# Altium schematic sheet RobotBoard.SchDoc: Robot Board Layout
size A3; DrawnBy: Bto45, Mmc305; SheetNumber: 1; SheetTotal: 2
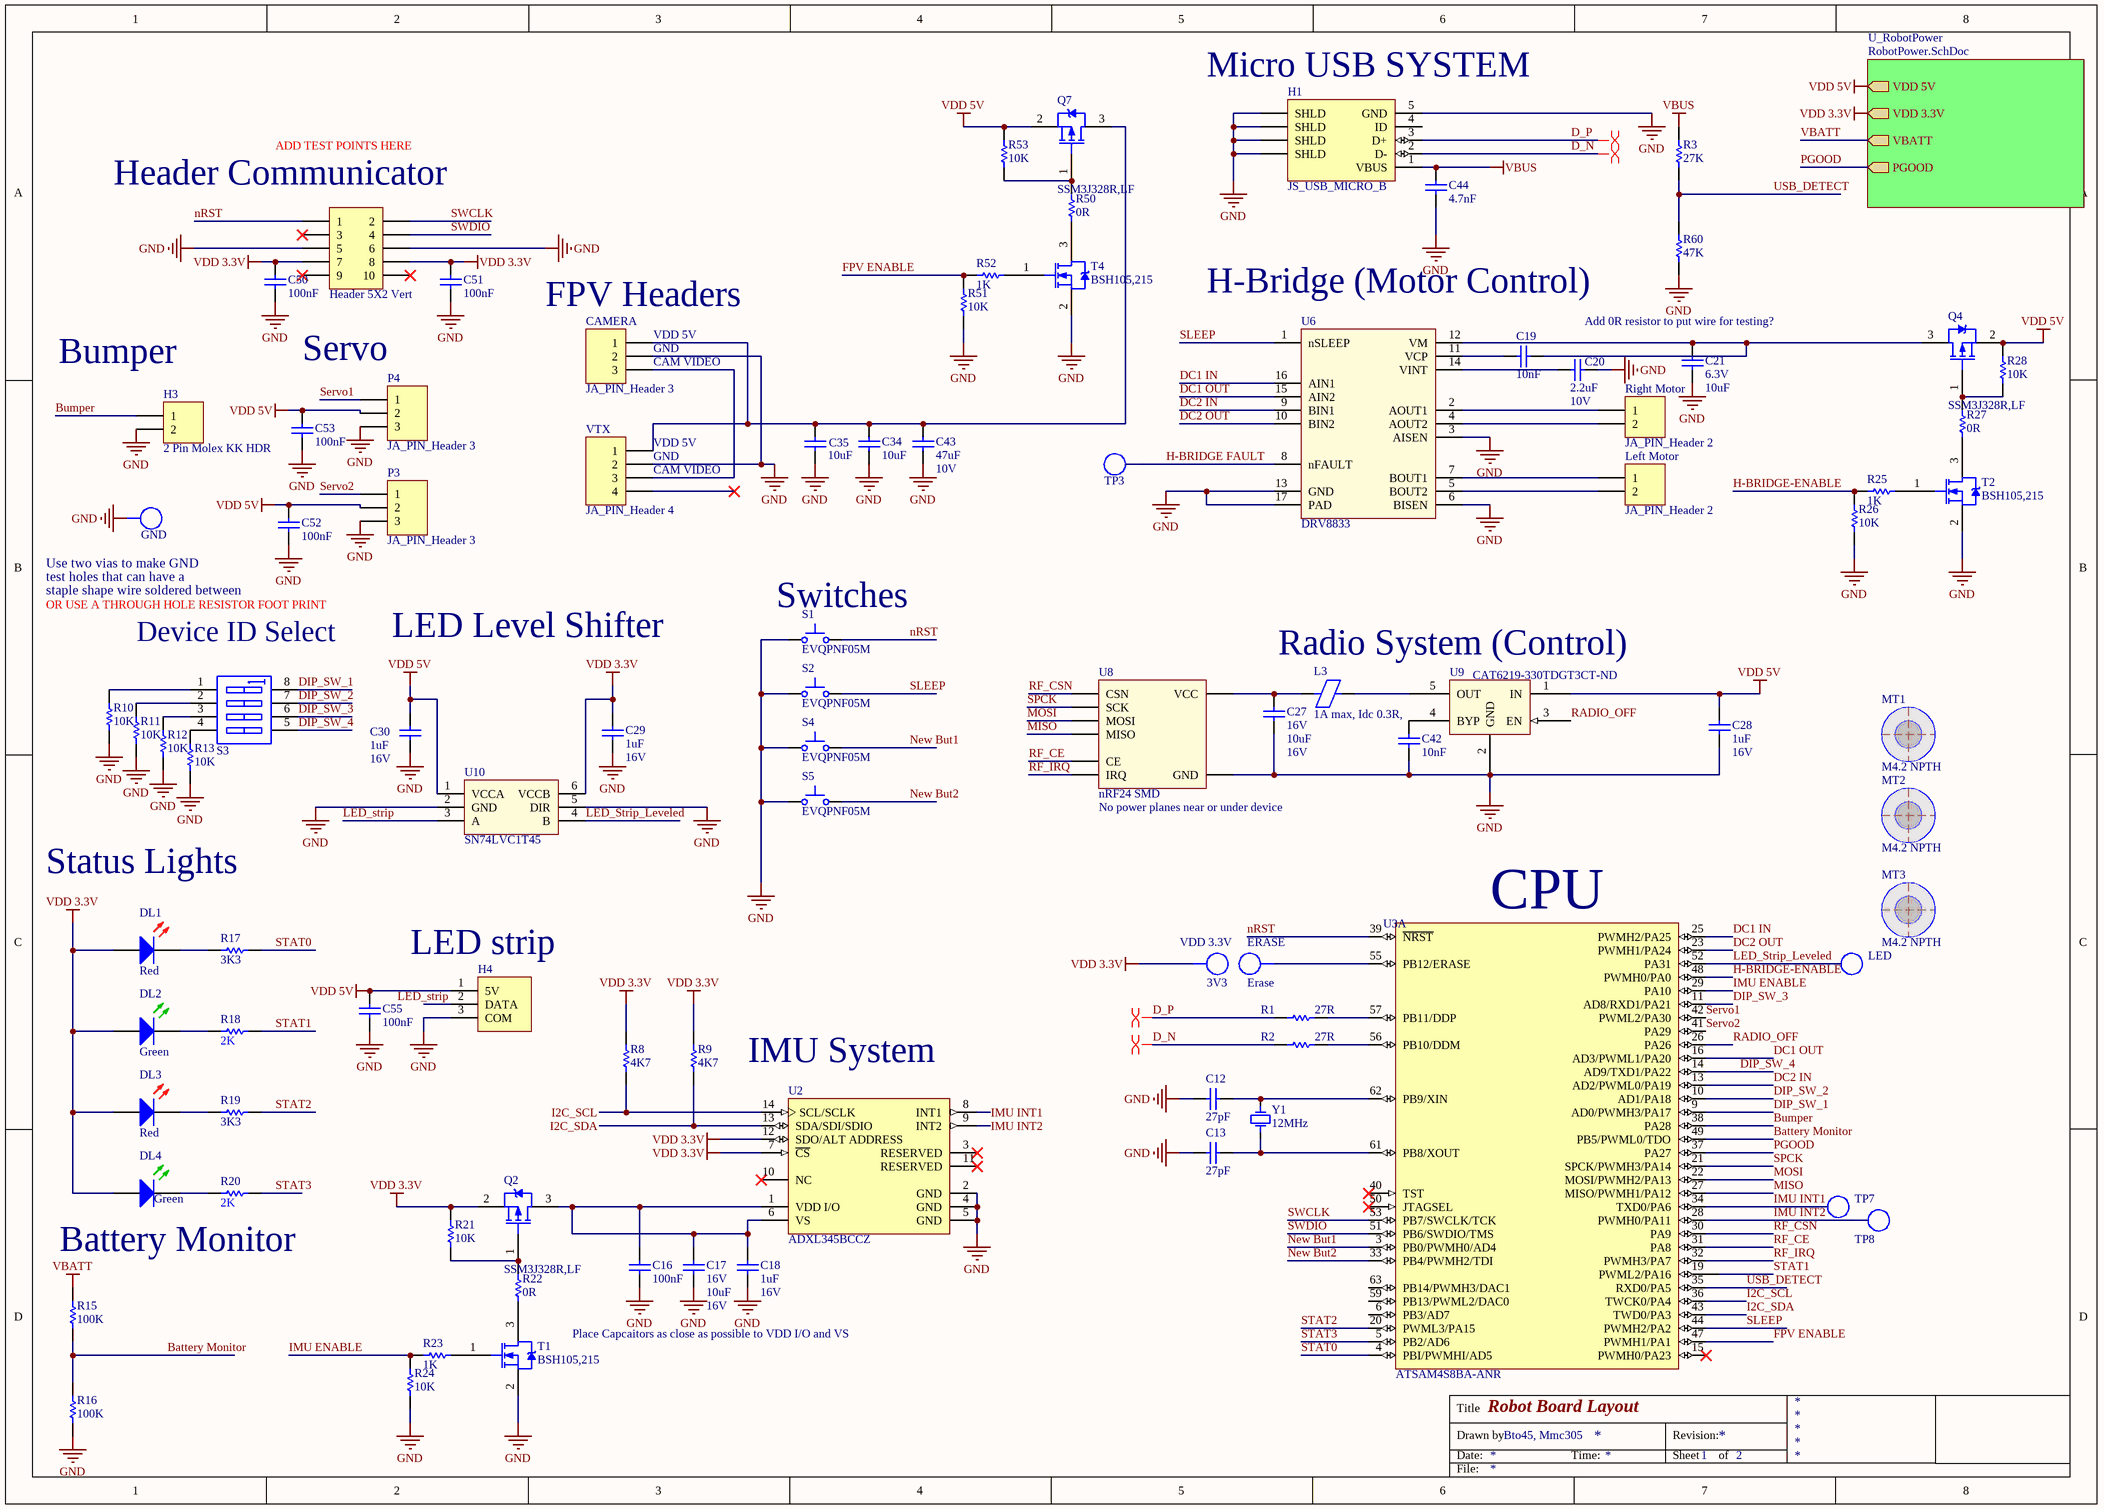
[diagram p0: RobotBoard.SchDoc]

## Parts
?  Header 5X2 Vert  [IDC2.54-V10D]
C12  27pF  [CAPC1608L]
C13  27pF  [CAPC1608L]
C16  100nF  [CAPC1608L]
C17  Voltage - Rated: 16V  [CAPC2012L]  (hidden comment: 10uF)
C18  Max Voltage: 16V  [CAPC1608L]  (hidden comment: 1uF)
C19  10nF  [CAPC1608L]
C20  Max Voltage: 10V  [CAPC1608L]  (hidden comment: 2.2uF)
C21  Voltage - Rated: 6.3V  [CAPC1608L]  (hidden comment: 10uF)
C27  Voltage - Rated: 16V  [CAPC2012L]  (hidden comment: 10uF)
C28  Max Voltage: 16V  [CAPC1608L]  (hidden comment: 1uF)
C29  Max Voltage: 16V  [CAPC1608L]  (hidden comment: 1uF)
C30  Max Voltage: 16V  [CAPC1608L]  (hidden comment: 1uF)
C34  10uF  [CAPC3216L]
C35  value 10uF  [CAPC3216L]  (hidden comment: 0.22uF)
C42  10nF  [CAPC1608L]
C43  Max Voltage: 10V  [CAPC3216L]  (hidden comment: 47uF)
C44  4.7nF  [CAPC1608L]
C50  100nF  [CAPC1608L]
C51  100nF  [CAPC1608L]
C52  100nF  [CAPC1608L]
C53  100nF  [CAPC1608L]
C55  100nF  [CAPC1608L]
CAMERA  JA_PIN_Header 3  [HDR1X3]
DL1  Red  [WL-SMCW0603]
DL2  Green  [WL-SMCW0603]
DL3  Red  [WL-SMCW0603]
DL4  Green  [WL-SMCW0603]
ERASE  TP  [TP_1206]  (value not drawn)  (no BOM)
GND  TP  [TP_1206]  (value not drawn)  (no BOM)
H1  JS_USB_MICRO_B  [FCI_USB_10118194-0001LF]
H3  2 Pin Molex KK HDR  [MOLEX_KK_2_HDR]
H4  3 Pin Molex KK Hdr  [MOLEX_KK_3_HDR]  (value not drawn)
L3  1A max, Idc 0.3R,  [INDC3216L]
LED  TP_0805  [TP_0805]  (value not drawn)
Left_Motor  JA_PIN_Header 2  [HDR1X2]
MT1  M4.2 NPTH  [MNT-HOLE_4.2mm_NPTH]  (no BOM)
MT2  M4.2 NPTH  [MNT-HOLE_4.2mm_NPTH]  (no BOM)
MT3  M4.2 NPTH  [MNT-HOLE_4.2mm_NPTH]  (no BOM)
P3  JA_PIN_Header 3  [HDR1X3]
P4  JA_PIN_Header 3  [HDR1X3]
Q2  SSM3J328R,LF  [SOT23_L]
Q4  SSM3J328R,LF  [SOT23_L]
Q7  SSM3J328R,LF  [SOT23_L]
R1  27R  [RESC1608L]
R2  27R  [RESC1608L]
R3  27K  [RESC1608L]
R8  4K7  [RESC1608L]
R9  4K7  [RESC1608L]
R10  10K  [RESC1608L]
R11  10K  [RESC1608L]
R12  10K  [RESC1608L]
R13  10K  [RESC1608L]
R15  100K  [RESC1608L]
R16  100K  [RESC1608L]
R17  3K3  [RESC1608L]
R18  2K  [RESC1608L]
R19  3K3  [RESC1608L]
R20  2K  [RESC1608L]
R21  10K  [RESC1608L]
R22  0R  [RESC1608L]
R23  1K  [RESC1608L]
R24  10K  [RESC1608L]
R25  1K  [RESC1608L]
R26  10K  [RESC1608L]
R27  0R  [RESC1608L]
R28  10K  [RESC1608L]
R50  0R  [RESC1608L]
R51  10K  [RESC1608L]
R52  1K  [RESC1608L]
R53  10K  [RESC1608L]
R60  47K  [RESC1608N]
Right_Motor  JA_PIN_Header 2  [HDR1X2]
S1  EVQPNF05M  [EVQPNF05M]
S2  EVQPNF05M  [EVQPNF05M]
S3  WS_SW DIP-4  [DIP_SW_4WAY_SMD -]  (value not drawn)
S4  EVQPNF05M  [EVQPNF05M]
S5  EVQPNF05M  [EVQPNF05M]
T1  BSH105,215  [SOT23_L]
T2  BSH105,215  [SOT23_L]
T4  BSH105,215  [SOT23_L]
TP3  TP_0805  [TP_0805]  (value not drawn)
TP7  TP_0805  [TP_0805]  (value not drawn)
TP8  TP_0805  [TP_0805]  (value not drawn)
U2  ADXL345BCCZ  [ADI-CC-14-1_V]
U3  ATSAM4S8BA-ANR  [LQFP64_L]  (part A of 2)
U6  DRV8833  [HTSOP16 DRV8833]
U8  nRF24 SMD  Warning: No power planes near or under device  [NRF24]
U9  Supplier Part Number: CAT6219-330TDGT3CT-ND  [SOT95P280X145-5N]  (hidden comment: CAT6219-330TDGT3)
U10  SN74LVC1T45  [SOT23-6_N]
VDD_3.3V  TP  [TP_1206]  (value not drawn)  (no BOM)
VTX  JA_PIN_Header 4  [HDR1X4]
Y1  12MHz  [6.0X3.5-4]

## Sub-sheets
U_RobotPower = RobotPower.SchDoc: VDD 5V (out), VDD 3.3V (out), VBATT (out), PGOOD (out)

## Nets
GND: ?.5 ?.6 C12.1 C13.1 C16.1 C17.1 C18.1 C20.2 C21.1 C27.1 C28.2 C29.1 C30.1 C34.1 C35.2 C42.1 C43.1 C44.1 C50.1 C51.1 C52.1 C53.1 C55.1 CAMERA.2 GND.1 H1.5(GND) H1.6(SHLD) H3.2 H4.3(COM) P3.3 P4.3 R10.1 R11.1 R12.1 R13.1 R16.1 R24.2 R26.2 R51.2 R60.2 S1.1 S2.1 S4.1 S5.1 T1.2 T2.2 T4.2 U2.2(GND) U2.4(GND) U2.5(GND) U6.3(AISEN) U6.6(BISEN) U6.13(GND) U6.17(PAD) U8.2(GND) U9.2(GND) U10.2(GND) U10.5(DIR) VTX.2
VBATT: R15.2 ; sheet U_RobotPower/VBATT
VBUS: C44.2 H1.1(VBUS) R3.1
VDD 3.3V: ?.7 ?.8 C29.2 C50.2 C51.2 DL1.2(A) DL2.2(A) DL3.2(A) DL4.2(A) Q2.2 R8.2 R9.2 R21.1 U2.7(~{CS}) U2.12(SDO/ALT_ADDRESS) U10.6(VCCB) VDD_3.3V.1 ; sheet U_RobotPower/VDD 3.3V
VDD 5V: C28.1 C30.2 C52.2 C53.2 C55.2 H4.1(5V) P3.2 P4.2 Q4.2 Q7.2 R28.1 R53.1 U9.1(IN) U10.1(VCCA) ; sheet U_RobotPower/VDD 5V
Battery Monitor: R15.1 R16.2 U3.49(PB5/PWML0/TDO)
Bumper: H3.1 U3.38(PA28)
D_N: H1.2(D-) R2.1
D_P: H1.3(D+) R1.1
DC1 IN: U3.25(PWMH2/PA25) U6.16(AIN1)
DC1 OUT: U3.16(AD3/PWML1/PA20) U6.15(AIN2)
DC2 IN: U3.13(AD2/PWML0/PA19) U6.9(BIN1)
DC2 OUT: U3.23(PWMH1/PA24) U6.10(BIN2)
DIP_SW_1: S3.8(B1) U3.9(AD0/PWMH3/PA17)
DIP_SW_2: S3.7(B2) U3.10(AD1/PA18)
DIP_SW_3: S3.6(B3) U3.11(AD8/RXD1/PA21)
DIP_SW_4: S3.5(B4) U3.14(AD9/TXD1/PA22)
FPV ENABLE: R51.1 R52.1 U3.47(PWMH1/PA1)
H-BRIDGE FAULT: TP3.1(TP) U6.8(nFAULT)
H-BRIDGE-ENABLE: R25.1 R26.1 U3.48(PWMH0/PA0)
I2C_SCL: R8.1 U2.14(SCL/SCLK) U3.36(TWCK0/PA4)
I2C_SDA: R9.1 U2.13(SDA/SDI/SDIO) U3.43(TWD0/PA3)
IMU ENABLE: R23.1 R24.1 U3.29(PA10)
IMU INT1: TP7.1(TP) U2.8(INT1) U3.34(TXD0/PA6)
IMU INT2: TP8.1(TP) U2.9(INT2) U3.28(PWMH0/PA11)
LED_strip: H4.2(DATA) U10.3(A)
LED_Strip_Leveled: LED.1(TP) U3.52(PA31) U10.4(B)
MISO: U3.27(MISO/PWMH1/PA12) U8.7(MISO)
MOSI: U3.22(MOSI/PWMH2/PA13) U8.6(MOSI)
New But1: S4.2 U3.3(PB0/PWMH0/AD4)
New But2: S5.2 U3.33(PB4/PWMH2/TDI)
nRST: ?.1 S1.2 U3.39(~{NRST})
PGOOD: U3.37(PA27) ; sheet U_RobotPower/PGOOD
RADIO_OFF: U3.26(PA26) U9.3(EN)
RF_CE: U3.31(PA8) U8.3(CE)
RF_CSN: U3.30(PA9) U8.4(CSN)
RF_IRQ: U3.32(PWMH3/PA7) U8.8(IRQ)
Servo1: P4.1 U3.42(PWML2/PA30)
Servo2: P3.1 U3.41(PA29)
SLEEP: S2.2 U3.44(PWMH2/PA2) U6.1(nSLEEP)
SPCK: U3.21(SPCK/PWMH3/PA14) U8.5(SCK)
STAT0: R17.2 U3.4(PBI/PWMHI/AD5)
STAT1: R18.2 U3.19(PWML2/PA16)
STAT2: R19.2 U3.20(PWML3/PA15)
STAT3: R20.2 U3.5(PB2/AD6)
SWCLK: ?.2 U3.53(PB7/SWCLK/TCK)
SWDIO: ?.4 U3.51(PB6/SWDIO/TMS)
USB_DETECT: R3.2 R60.1 U3.35(RXD0/PA5)
NetC12_2: C12.2 U3.62(PB9/XIN) Y1.1(OSC1)
NetC13_2: C13.2 U3.61(PB8/XOUT) Y1.3(OSC2)
NetC16_2: C16.2 C17.2 C18.2 Q2.3 U2.1(VDD_I/O) U2.6(VS)
NetC19_1: C19.1 U6.11(VCP)
NetC19_2: C19.2 C21.2 Q4.3 U6.12(VM)
NetC20_1: C20.1 U6.14(VINT)
NetC27_2: C27.2 L3.1 U8.1(VCC)
NetC34_2: C34.2 C35.1 C43.2 CAMERA.1 Q7.3 VTX.1
NetC42_2: C42.2 U9.4(BYP)
NetCAMERA_3: CAMERA.3 VTX.3
NetDL1_1: DL1.1(K) R17.1
NetDL2_1: DL2.1(K) R18.1
NetDL3_1: DL3.1(K) R19.1
NetDL4_1: DL4.1(K) R20.1
NetERASE_1: ERASE.1 U3.55(PB12/ERASE)
NetL3_2: L3.2 U9.5(OUT)
NetLeft_Motor_1: Left_Motor.1 U6.7(BOUT1)
NetLeft_Motor_2: Left_Motor.2 U6.5(BOUT2)
NetQ2_1: Q2.1 R21.2 R22.1
NetQ4_1: Q4.1 R27.1 R28.2
NetQ7_1: Q7.1 R50.1 R53.2
NetR1_2: R1.2 U3.57(PB11/DDP)
NetR2_2: R2.2 U3.56(PB10/DDM)
NetR10_2: R10.2 S3.1(A1)
NetR11_2: R11.2 S3.2(A2)
NetR12_2: R12.2 S3.3(A3)
NetR13_2: R13.2 S3.4(A4)
NetR22_2: R22.2 T1.3
NetR23_2: R23.2 T1.1
NetR25_2: R25.2 T2.1
NetR27_2: R27.2 T2.3
NetR50_2: R50.2 T4.3
NetR52_2: R52.2 T4.1
NetRight_Motor_1: Right_Motor.1 U6.2(AOUT1)
NetRight_Motor_2: Right_Motor.2 U6.4(AOUT2)

Not connected (* = marked no-connect by the designer): ? 3* 9* 10*; H1 4(ID); U2 3(RESERVED)* 10(NC)* 11(RESERVED)*; U3 6(PB3/AD7) 15(PWMH0/PA23)* 40(TST)* 50(JTAGSEL)* 59(PB13/PWML2/DAC0) 63(PB14/PWMH3/DAC1); VTX 4*

## Layout directives
differential pair: D_N, D_P

## Notes on the sheet
- (near H1) Micro USB SYSTEM
- ADD TEST POINTS HERE
- Header Communicator
- (near CAMERA) FPV Headers
- H-Bridge (Motor Control)
- (near H3) Bumper
- (near P4) Servo
- (near CAMERA) VDD 5V
- (near CAMERA) GND
- (near CAMERA) CAM VIDEO
- Add 0R resistor to put wire for testing?
- (near VTX) VDD 5V
- (near VTX) GND
- (near VTX) CAM VIDEO
- (near GND) Use two vias to make GND
- test holes that can have a
- staple shape wire soldered between
- OR USE A THROUGH HOLE RESISTOR FOOT PRINT
- Device ID Select
- LED Level Shifter
- (near S1) Switches
- Radio System (Control)
- Status Lights
- (near U3) CPU
- (near H4) LED strip
- (near VDD_3.3V) 3V3
- (near ERASE) Erase
- IMU System
- Battery Monitor
- Place Capcaitors as close as possible to VDD I/O and VS
- Title
- Drawn by:
- Date:
- Time:
- Revision:
- Sheet
- of
- File:

## Library data of the parts
? = JA_HDR_IDC_5X2_VERT: IDC Header, 2,54mm, 10-Pin, Vert; Supplier: ECE Dept; Supplier 1: Farnell; Supplier Part Number 1: 1096985; Storage Location: ECE Dept Store
C12 C13 = CC_27pF_0603: CAP CER 27pF NPO/COG +-5% 50V 0603; PackageReference: 0603; Code_IPC: 1608 [0603]; Verify: *; Supplier: ECE Dept; Storage Location: PCB Assembly WS; Value: 27pF
C16 C50-C53 C55 = CC_100nF_0603: CAP CER 100nF X7R +-10% 50V 0603; PackageReference: 0603; Code_IPC: 1608 [0603]; Verify: *; Supplier: ECE Dept; Storage Location: PCB Assembly WS; Value: 100nF
C17 C27 = CC_10uF_0805_16V: CAP CER 10uF X5R 16V 0805; Manufacturer: Samsung Electro-Mechanics; Manufacturer Part Number: CL21A106KOQNNWE; Note: Footprint corresponds to dimensions for bulk cassette packaging. This case size has tightened tolerances.; Tolerance: ±10%; Notification: Current market demand for these product types have resulted in fluctuating and extending lead times. Lead times may differ.; PackageReference: 0805; Code_IPC: 2012[0805]; Supplier 1: Digi-Key; RoHS: RoHS Compliant; Category: Capacitors; Stock 1: 20000; Pricing 1: 1=0.35, 10=0.25, 100=0.1178, 500=0.08254, 1000=0.06831 (NZD); Packaging: Cut Tape (CT); Part Status: Active; Temperature Coefficient: X5R; Operating Temperature: -55°C ~ 85°C; Features: -; Ratings: -; Applications: General Purpose; Mounting Type: Surface Mount, MLCC; Package / Case: 0805 (2012 Metric); Size / Dimension: 0.079" L x 0.049" W (2.00mm x 1.25mm); Height - Seated (Max): -; Thickness (Max): 0.055" (1.40mm); Lead Spacing: -; Lead Style: -; ComponentLink1URL: http://www.samsungsem.com/kr/support/product-search/mlcc/CL21A106KOQNNWE.jsp; ComponentLink1Description: http://www.samsungsem.com/kr/support/product-search/mlcc/CL21A106KOQNNWE.jsp; Supplier Part Number 1: 1276-2894-1-ND; Value: 10uF; Max Voltage: 16V
C18 C28-C30 = CC_1uF_0603: CAP CER 1uF Y5V -20% +80% 16V 0603; PackageReference: 0603; Code_IPC: 1608 [0603]; Verify: *; Supplier: ECE Dept; Storage Location: PCB Assembly WS; Value: 1uF
C19 C42 = CC_10nF_0603: CAP CER 10nF X7R +-10% 50V 0603; PackageReference: 0603; Code_IPC: 1608 [0603]; Verify: *; Supplier: ECE Dept; Storage Location: PCB Assembly WS; Value: 10nF
C20 = CC_2.2uF_0603: CAP CER 2.2uF X5R +-20% 10V 0603; PackageReference: 0603; Code_IPC: 1608 [0603]; Verify: *; Supplier: ECE Dept; Storage Location: PCB Assembly WS; Value: 2.2uF
C21 = CC_10uF_0603: CAP CER 10UF X5R +-20% 6V3 0603; Supplier: ECE Dept; Storage Location: PCB Assembly WS; Value: 10uF
C34 C35 C43 = CC_47uF_1206: CAP CER 47uF X5R -/+20% 10V 1206; Verify: *; Supplier: ECE Dept; Storage Location: PCB Assembly WS; Dielectric: X5R; Footprint: 1210 (3225 metric); MoV: 10V
  C34: Value: 10uF
  C43: Value: 47uF
C44 = CC_4.7nF_0603: CAP CER 4.7nF X7R +-10% 50V 0603; PackageReference: 0603; Code_IPC: 1608 [0603]; Verify: *; Supplier: ECE Dept; Storage Location: PCB Assembly WS; Value: 4.7nF
CAMERA P3 P4 = JA_PIN_Header 3: Header, 3-Pin; LatestRevisionDate: 17-Jul-2002; LatestRevisionNote: Re-released for DXP Platform.; Publisher: Altium Limited
DL1 DL3 = DL_150060RS75000: LED Red 250mcd 0603 SMD; Manufacturer: WURTH ELEKTRONIK; Forward Current If: 30; Forward Voltage: 2; Lens Shape: Rectangular; Luminous Intensity: 250; Wavelength Typ: 625; Viewing Angle: 140°; LED Mounting: SMD; Supplier 1: Farnell; Supplier Part Number 1: 2322071; Manufacturer Part Number: 150060RS75000; Storage Location: PCB Assembly WS; Supplier: ECE Dept; LED Colour: Red
DL2 DL4 = DL_150060GS75000: LED Green 430mcd 0603 SMD; Manufacturer: WURTH ELEKTRONIK; Forward Current If: 30; Wavelength Typ: 520; Forward Voltage: 3.2; Lens Shape: Rectangular; Luminous Intensity: 430; Viewing Angle: 140°; LED Mounting: SMD; Supplier 1: Farnell; Supplier Part Number 1: 2322070; Manufacturer Part Number: 150060GS75000; Storage Location: PCB Assembly WS; Supplier: ECE Dept; LED Colour: Green
ERASE GND VDD_3.3V = TP_1206: Test-Point 3.3x1.6x2.1mm SMD; Manufacturer: Harwin Inc; Manufacturer Part Number: S1751-46R; Manufacturer PN: *; Storage Location: ProtoPlace; Mounting Type: Surface Mount; Type: PC Test Point; Supplier 1: Digi-Key; Supplier Part Number 1: 952-1478-2-ND; Supplier 2: Farnell; Supplier Part Number 2: 1826282; Supplier: ECE Dept; Value: TP
H1 = JS_USB_MICRO_B_SMT: CONN USB MICRO B RECPT SMT R/A; Manufacturer: FCI; Manufacturer Part Number: 10118194-0001LF; Gender: Receptacle; Number of Contacts: 5; Specifications: USB 2.0; Supplier 1: Digi-Key; Supplier Part Number 1: 609-4618-1-ND; Features: Shielded, Solder Retention; Mounting Type: Surface Mount, Right Angle, Horizontal
H3 = JA_MOLEX_KK_2POS: CONN HEADER 2POS 2.54mm VERT_Thru Hole; Supplier 1: Farnell; Supplier Part Number 1: 1462926; Supplier: ECE Dept; Storage Location: ECE Dept Store; Value: 2 Pin Molex KK HDR
H4 = LED_Strip_Header: CONN HEADER 3POS 2.54mm VERT_Thru Hole; Manufacturer: Molex; Manufacturer PN: 22-23-2031; Supplier Part Number 1: 9731156; Supplier: ECE Dept; Supplier 1: Farnell; Storage Location: ECE Dept Store; Value: 3 Pin Molex KK Hdr
L3 = IN_Ferrite-Bead: Ferrite Bead, Rdc 0.3R, Z100MHZ 600R, Imax 1A, SMD 1206; Manufacturer: FAIR-RITE; Manufacturer PN: 2512066017Y1; DC Current Rating: 1; DC Resistance Max: 0.08; Ferrite Case Style: 1206 ^3216 Metric]; Frequency Range: 50MHz to 1; Impedance: 600; Impedance Tolerance: ± 25%; Supplier: ECE Dept; Storage Location: PCB Assembly WS; Ferrite Mounting: SMD; Supplier 1: Farnell; Supplier Part Number 1: 1612060; Manufacturer Part Number: 2512066017Y1; Value: 1A max, Idc 0.3R,
LED TP3 TP7 TP8 = TP_0805: Test Point 2.0X0.9X1.2mm SMD; Manufacturer: TE Connectivity AMP Connectors; Manufacturer Part Number: 1625854-2; Supplier 1: Digi-Key; Mounting Type: Surface Mount; Terminal: 0.079" x 0.049" x 0.057" (2.00mm x 1.25mm x 1.45mm); Type: PC Test Point; Supplier Part Number 1: A106144CT-ND
Left_Motor Right_Motor = JA_PIN_Header 2: Header, 2-Pin; LatestRevisionDate: 17-Jul-2002; LatestRevisionNote: Re-released for DXP Platform.; Publisher: Altium Limited
MT1-MT3 = MC_M4.2_HOLE: Fixing M4.2 Mount Hole NPTH; Manufacturer: Hi-Q; Manufacturer PN: 4NE Series M4 Clearance; price: 0; Supplier: ECE Dept; value: M4.2 NPTH
Q2 Q4 Q7 = TM_SSM3J328R: MOSFET P-CH 20V 6A SOT23-3; Manufacturer: Toshiba; FET Feature: Logic Level Gate, 1.5V Drive; FET Type: MOSFET P-Channel, Metal Oxide; Gate Charge (Qg) @ Vgs: 12.8nC @ 4.5V; Input Capacitance (Ciss) @ Vds: 840pF @ 10V; Power - Max: 1W; Rds On Max: 29.8mR; Drain to Source Resistance: 47.4mR; Turn-On Delay Time: 32ns; Power Dissipation: 2W; Number of Channels: 1; Turn-Off Delay Time: 107ns; Gate to Source Voltage (Vgs): 8V; Input Capacitance: 840pF; Element Configuration: Single; Drain to Source Breakdown Voltage: -20V; Vgs(th) (Max) @ Id: 1V @ 1mA; Current - Continuous Drain (Id) @ 25° C: 6A; Drain to Source Voltage (Vdss): 20V; Package / Case: SOT-23-3 Flat Leads; Supplier Device Package: SOT-23F; Pricing: 1=0.79, 10=0.658, 25=0.5772, 100=0.4939, 250=0.42836, 500=0.36284, 1000=0.27972 (NZD); Storage Location: PCB Assembly WS; Supplier: Digi-Key; ComponentLink1URL: https://datasheet.ciiva.com/11158/ssm3j328r-datasheet-en-20140301-11158652.pdf; ComponentLink1Description: https://datasheet.ciiva.com/11158/ssm3j328r-datasheet-en-20140301-11158652.pdf; Supplier Part Number: SSM3J328RLFDKR-ND; Max Operating Temperature: 150°C; Mount: Surface Mount; Packaging: Tape and Reel; Min Operating Temperature: -55°C; Continuous Drain Current (ID): 6A; Radiation Hardening: No; Max Power Dissipation: 1W; Package Quantity: 3000; Case/Package: SOT-23-3; Number of Pins: 3; Number of Elements: 1; Supplier 1: Digi-Key; Supplier Part Number 1: SSM3J328RLFDKR-ND; Manufacturer Part Number: SSM3J328R,LF
R1 R2 = RS_27R: RES 27 OHM 1/10W 5% 0603 SMD; Storage Location: PCB Assembly WS; Supplier: ECE Dept; Value: 27R
R3 = RS_27K: RES 27K OHM 1/10W 5% 0603 SMD; Storage Location: PCB Assembly WS; Supplier: ECE Dept; Value: 27K
R8 R9 = RS_4K7: RES 4.7K OHM 1/10W 5% 0603 SMD; Storage Location: PCB Assembly WS; Supplier: ECE Dept; Value: 4K7
R10-R13 R21 R24 R26 R28 R51 R53 = RS_10K: RES 10.0K OHM 1/10W 5% 0603 SMD; Storage Location: PCB Assembly WS; Supplier: ECE Dept; Value: 10K
R15 R16 = RS_100K: RES 100K OHM 1/10W 5% 0603 SMD; Storage Location: PCB Assembly WS; Supplier: ECE Dept; Value: 100K
R17 R19 = RS_3K3: RES 3.3K OHM 1/10W 5% 0603 SMD; Storage Location: PCB Assembly WS; Supplier: ECE Dept; Value: 3K3
R18 R20 = RS_2K: RES 2K OHM 1/10W 5% 0603 SMD; Storage Location: PCB Assembly WS; Supplier: ECE Dept; Value: 2K
R22 R27 R50 = RS_0R0: RES 0.0 OHM 1/10W 5% 0603 SMD; Storage Location: PCB Assembly WS; Supplier: ECE Dept; Value: 0R
R23 R25 R52 = RS_1K: RES 1.0K OHM 1/10W 5% 0603 SMD; Storage Location: PCB Assembly WS; Supplier: ECE Dept; Value: 1K
R60 = RS_47K: RES 47.0K OHM 1/10W 5% 0603 SMD; Storage Location: PCB Assembly WS; Supplier: ECE Dept; Value: 47K
S1 S2 S4 S5 = WS_EVQPNF05M: Panasonic 6 x 3.5mm SMD Light Touch Switch Type SMD; PackageDescription: 6.0 x 3.5 mm; Supplier 1: Farnell; Supplier Part Number 1: 2079481; Manufacturer: Panasonic; Manufacturer PN: EVQPNF05M; Supplier 2: Digi-Key; Supplier Part Number 2: P13598SCT-ND; Storage Location: PCB Assembly WS; Supplier: ECE Dept
S3 = WS_SW DIP-4: DIP Switch, 4 Position, SPST SMD; Manufacturer: OMRON ELECTRONIC COMPONENTS; Manufacturer Part Number: A6SN-4101; Contact Current DC Max: 25; External Length / Height: 12.1; No. of Switch Positions: 4; Pitch Spacing: 2.54; Contact Configuration: SPST; Supplier 1: Farnell; Supplier Part Number 1: 2029425; Storage Location: PCB Assembly WS; Supplier: ECE Dept
T1 T2 T4 = TM_BSH105: MOSFET N-CH 20V 1.05A SOT-23; Manufacturer: NXP Semiconductors; FET Type: MOSFET N-Channel, Metal Oxide; Gate Charge (Qg) @ Vgs: 3.9nC @ 4.5V; Input Capacitance (Ciss) @ Vds: 152pF @ 16V; Power - Max: 417mW; Rds On (Max) @ Id, Vgs: 200 mOhm @ 600mA, 4.5V; Supplier 1: Farnell; Supplier 2: Digi-Key; Current - Continuous Drain (Id) @ 25° C: 1.05A; Drain to Source Voltage (Vdss): 20V; Package / Case: TO-236-3, SC-59, SOT-23-3; Pricing: 1=0.53, 10=0.42, 25=0.3544, 100=0.2885, 250=0.23896, 500=0.1974, 1000=0.14785 (NZD); Supplier Part Number 1: 1758066; Supplier Part Number 2: 568-6215-1-ND; Storage Location: PCB Assembly WS; Supplier: ECE Dept; Manufacturer Part Number: BSH105,215
U2 = ADXL345BCCZ: Accelerometer 3-Axis, +/-2 g / +/-4 g / +/-8 g / +/-16 g with Digital Output, 1.6 KHz BW, Industrial, 14-pin LGA, Tray; Manufacturer: Analog Devices; Sensitivity: 256/128/64/32 LSB/g; Voltage Supply (V): 2.0 to 3.6; Supply Current: 140 uA; # of Axes: 3; -3dB Bandwidth: 1.6 KHz; PackageReference: CC-14-1; ComponentLink1Description: Manufacturer URL; Packing: Tray; ComponentLink4URL: http://www.analog.com/en/mems-sensors/mems-inertial-sensors/adxl345/products/product.html; ComponentLink2URL: http://www.analog.com/static/imported-files/data_sheets/ADXL345.pdf; Mounting Technology: Surface Mount; ComponentLink3URL: http://www.analog.com/static/imported-files/data_sheets/ADXL343.pdf; PartNumber: ADXL345BCCZ; ComponentLink4Description: Product URL; Output Type: Digital; ComponentLink3Description: Package Specification; DatasheetVersion: Rev. D; PackageVersion: 03-16-2010-A, 03/2010; ComponentLink1URL: http://www.analog.com/en/index.html; ComponentLink2Description: Datasheet; PackageDescription: 14-Pin Land Grid Array, 3 x 5 mm Body, 0.8 mm Pitch; Manufacturer 1: Analog Devices; Manufacturer Part Number 1: ADXL345BCCZ
U3 = SE_ATSAM4S16BA-MU: IC MCU 32BIT 512KB FLASH 64LQFP; Manufacturer: Atmel; Connectivity: I²C, IrDA, Memory Card, SPI, SSC, UART/USART, USB; Core Processor: ARM® Cortex®-M4; Core Size: 32-Bit; Data Converters: A/D 11x12b, D/A 2x12b; Number of I/O: 47; Peripherals: Brown-out Detect/Reset, DMA, POR, PWM, WDT; Program Memory Size: 512KB (512K x 8); RAM Size: 128K x 8; Speed: 120MHz; Voltage - Supply (Vcc/Vdd): 1.62 V ~ 3.6 V; PackageVersion: revJ, Jul-2007; PackageReference: 64PS; PackageDescription: 64-Pin Quad Flat No-Lead (QFN) Sawn, 9 x 9 x 1.0 mm Body, 0.5 mm Pitch, Exposed Pad; Code_JEDEC: MO-220VMMD-3; ComponentLink1Description: Manufacturer URL; ComponentLink1URL: http://www.atmel.com/; ComponentLink2Description: SAM4S Series Datasheet; ComponentLink2URL: http://www.atmel.com/dyn/resources/prod_documents/11100.pdf; ComponentLink3Description: SAM4S Series Summary; ComponentLink3URL: http://www.atmel.com/dyn/resources/prod_documents/11100S.pdf; Supplier 1: Digi-Key; Package / Case: 64-LQFP; Packaging: Cut Tape (CT); Program Memory Type: FLASH; Supplier Part Number 1: ATSAM4S8BA-ANRCT-ND; Manufacturer Part Number: ATSAM4S8BA-ANR
U6 = DRV8833: Dual H-Bridge Motor Driver 1.5A; ComponentLink1Description: DRV8833 Datasheet; ComponentLink1URL: \\maxwell\elecapp\AltiumDesigner\Libraries\DatasheetsNew\ENCE461\drv8833pwpr.pdf
U8 = NRF24: nRF24 SMD Module
U9 = SV_CAT6219-330TDGT3: IC REG LIN 3.3V 500MA TSOT23-5; Voltage - Input (Max): 5.5V; Voltage Dropout (Max): 0.5V @ 500mA; Manufacturer Part Number: CAT6219-330TDGT3; Base Part Number: CAT6219; Current - Output: 500mA; Package / Case: SOT-23-5 Thin, TSOT-23-5; Supplier: Digi-Key; Supplier Device Package: TSOT-23-5; Voltage - Output (Min/Fixed): 3.3V; ComponentLink1URL: http://www.onsemi.com/pub/Collateral/CAT6219-D.PDF; ComponentLink1Description: http://www.onsemi.com/pub/Collateral/CAT6219-D.PDF; Supplier 1: Digi-Key; ComponentLink2Description: CAT6219 Datasheet; ComponentLink2URL: \\maxwell\elecapp\AltiumDesigner\Libraries\DatasheetsNew\ENCE461\CAT6219-D.PDF
U10 = SN74LVC1T45: 1.8V - 5V level converter
VTX = JA_PIN_Header 4: Header, 4-Pin; LatestRevisionDate: 17-Jul-2002; LatestRevisionNote: Re-released for DXP Platform.; Publisher: Altium Limited
Y1 = XT_CRYSTAL_12MHz_18pF: CRYSTAL 12MHZ 18PF 6X3.5mm SMD; Manufacturer: CTS-Frequency Controls; Manufacturer Part Number: 406C35D12M00000; ESR (Equivalent Series Resistance): 60 Ohm; Frequency Stability: ±50ppm; Frequency Tolerance: ±30ppm; Operating Mode: Fundamental; Supplier 1: Digi-Key; Height: 0.047" (1.20mm); Load Capacitance: 18pF; Mounting Type: Surface Mount; Operating Temperature: -20°C ~ 70°C; Package / Case: 4-SMD, No Lead (DFN, LCC); Size / Dimension: 0.236" L x 0.138" W (6.00mm x 3.50mm); Supplier Part Number 1: CTX855CT-ND; Frequency: 12MHz